# Altium schematic sheet 02.DC-DCConverter.SchDoc: ARES_R06_Power
size A4; CompanyName: HIGEN; DrawnBy: 212115; Revision: V0.21; SheetNumber: 2; SheetTotal: 5; DrawingNumber: 임시도면
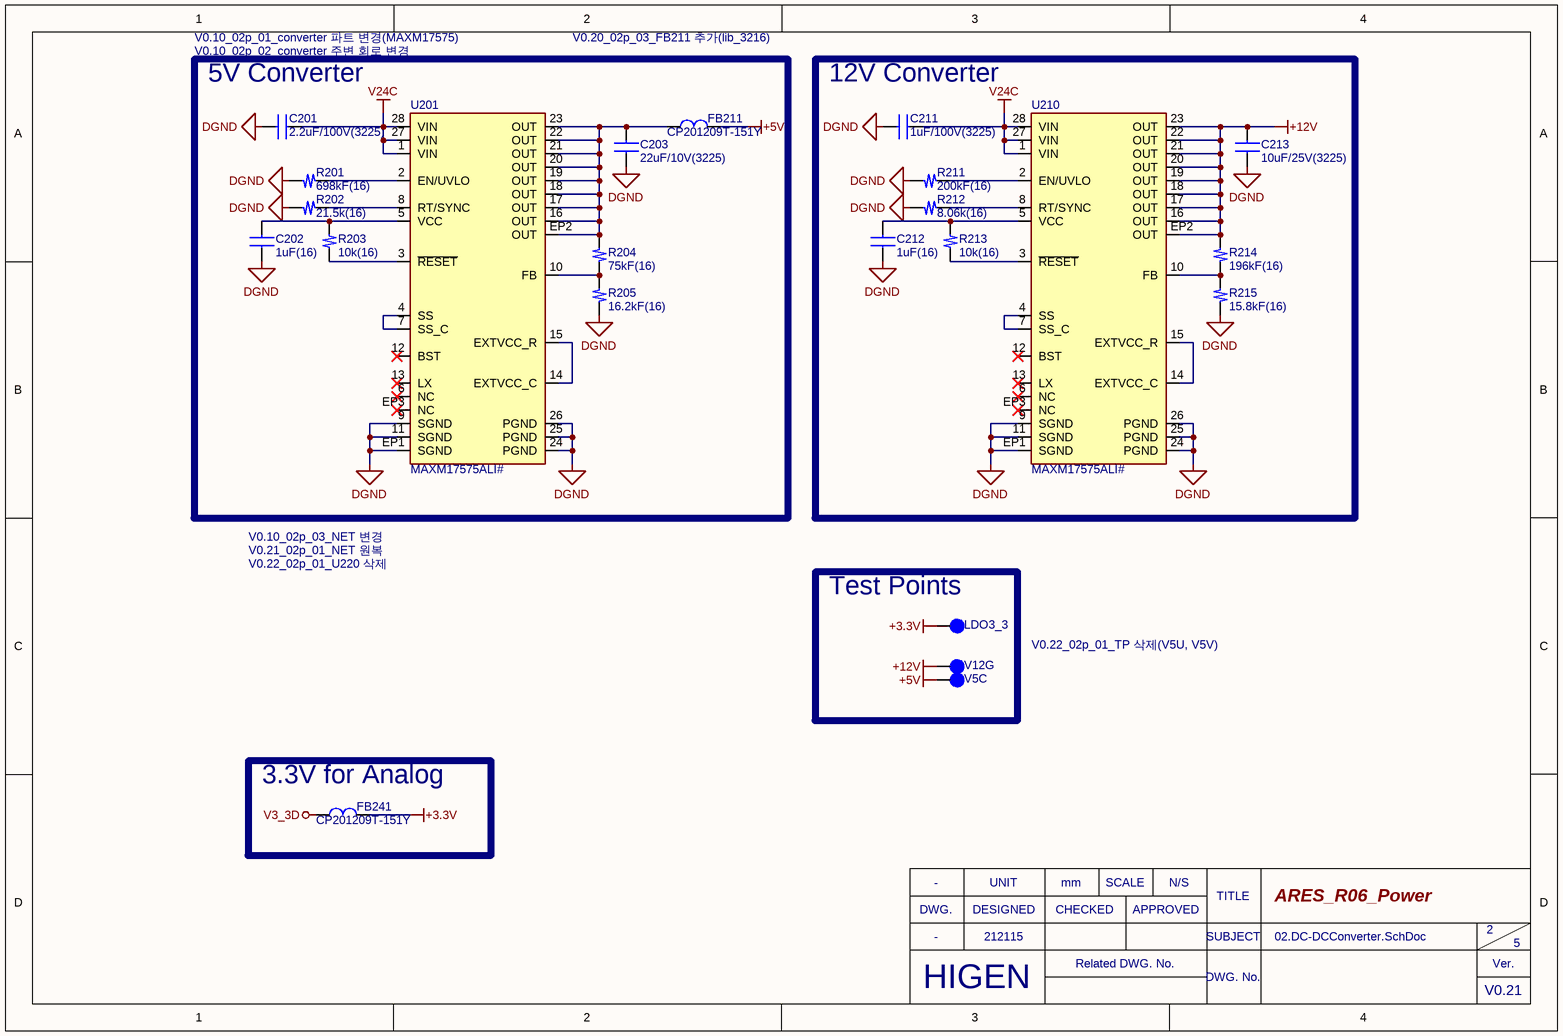
[diagram p0: 02.DC-DCConverter.SchDoc]

## Parts
C201  2.2uF/100V(3225)  [C-3225]
C202  1uF(16)  [C-1608S]
C203  22uF/10V(3225)  [C-3225]
C211  1uF/100V(3225)  [C-3225]
C212  1uF(16)  [C-1608S]
C213  10uF/25V(3225)  [C-3225]
FB211  CP201209T-151Y  [L-2012]
FB241  CP201209T-151Y  [L-2012]
LDO3_3  TP  [TP-SMD]  (value not drawn)
R201  698kF(16)  [R-1608S]
R202  21.5k(16)  [R-1608S]
R203  10k(16)  [R-1608S]
R204  75kF(16)  [R-1608S]
R205  16.2kF(16)  [R-1608S]
R211  200kF(16)  [R-1608S]
R212  8.06k(16)  [R-1608S]
R213  10k(16)  [R-1608S]
R214  196kF(16)  [R-1608S]
R215  15.8kF(16)  [R-1608S]
U201  MAXM17575ALI#  [LGA28-0.5MM-10X6.5_3.45]
U210  MAXM17575ALI#  [LGA28-0.5MM-10X6.5_3.45]
V5C  TP  [TP-SMD]  (value not drawn)
V12G  TP  [TP-SMD]  (value not drawn)

## Blocks framed on the sheet
5V Converter: C201-C203 FB211 R201-R205 U201
12V Converter: C211-C213 R211-R215 U210
Test Points: LDO3_3 V5C V12G
3.3V for Analog: FB241

## Nets
+3.3V: FB241.2 LDO3_3.1
+5V: FB211.2 V5C.1
+12V: C213.2 R214.1(P1) U210.16(OUT) U210.17(OUT) U210.18(OUT) U210.19(OUT) U210.20(OUT) U210.21(OUT) U210.22(OUT) U210.23(OUT) U210.EP2(OUT) V12G.1
DGND: C201.1 C202.2 C203.1 C211.1 C212.2 C213.1 R201.2(P2) R202.2(P2) R205.2(P2) R211.2(P2) R212.2(P2) R215.2(P2) U201.9(SGND) U201.11(SGND) U201.24(PGND) U201.25(PGND) U201.26(PGND) U201.EP1(SGND) U210.9(SGND) U210.11(SGND) U210.24(PGND) U210.25(PGND) U210.26(PGND) U210.EP1(SGND)
V3_3D: FB241.1
V24C: C201.2 C211.2 U201.1(VIN) U201.27(VIN) U201.28(VIN) U210.1(VIN) U210.27(VIN) U210.28(VIN)
NetC202_1: C202.1 R203.1(P1) U201.5(VCC)
NetC203_2: C203.2 FB211.1 R204.1(P1) U201.16(OUT) U201.17(OUT) U201.18(OUT) U201.19(OUT) U201.20(OUT) U201.21(OUT) U201.22(OUT) U201.23(OUT) U201.EP2(OUT)
NetC212_1: C212.1 R213.1(P1) U210.5(VCC)
NetR201_1: R201.1(P1) U201.2(EN/UVLO)
NetR202_1: R202.1(P1) U201.8(RT/SYNC)
NetR203_2: R203.2(P2) U201.3(~{RESET})
NetR204_2: R204.2(P2) R205.1(P1) U201.10(FB)
NetR211_1: R211.1(P1) U210.2(EN/UVLO)
NetR212_1: R212.1(P1) U210.8(RT/SYNC)
NetR213_2: R213.2(P2) U210.3(~{RESET})
NetR214_2: R214.2(P2) R215.1(P1) U210.10(FB)
NetU201_4: U201.4(SS) U201.7(SS_C)
NetU201_14: U201.14(EXTVCC_C) U201.15(EXTVCC_R)
NetU210_4: U210.4(SS) U210.7(SS_C)
NetU210_14: U210.14(EXTVCC_C) U210.15(EXTVCC_R)

Not connected (* = marked no-connect by the designer): U201 6(NC)* 12(BST)* 13(LX)* EP3(NC)*; U210 6(NC)* 12(BST)* 13(LX)* EP3(NC)*

## Notes on the sheet
- V0.10_02p_01_converter 파트 변경(MAXM17575)
- V0.20_02p_03_FB211 추가(lib_3216)
- V0.10_02p_02_converter 주변 회로 변경
- V0.10_02p_03_NET 변경
- V0.21_02p_01_NET 원복
- V0.22_02p_01_U220 삭제
- V0.22_02p_01_TP 삭제(V5U, V5V)
- -
- DWG.
- UNIT
- DESIGNED
- mm
- CHECKED
- SCALE
- APPROVED
- N/S
- TITLE
- HIGEN
- Related DWG. No.
- SUBJECT
- DWG. No.
- Ver.

## Library data of the parts
C201-C203 C211-C213 = CAP_NP
FB211 FB241 = FBead
LDO3_3 V5C V12G = 2H_TestPointThroughHole: Mfr: Keystone Electronics; MfrNum: 5002; TIIntPartnumber: 2H0026; DescriptiveText: Testpoint Miniature Through Hole; Vendor: Digikey; Cost100: 0.163; Cost10K: 0.10; PartName: TestPointThroughHole
R201-R205 R211-R215 = Res